# Altium schematic sheet 1_ABSTM32_Power.SchDoc
size A4; SheetNumber: 2; SheetTotal: 4
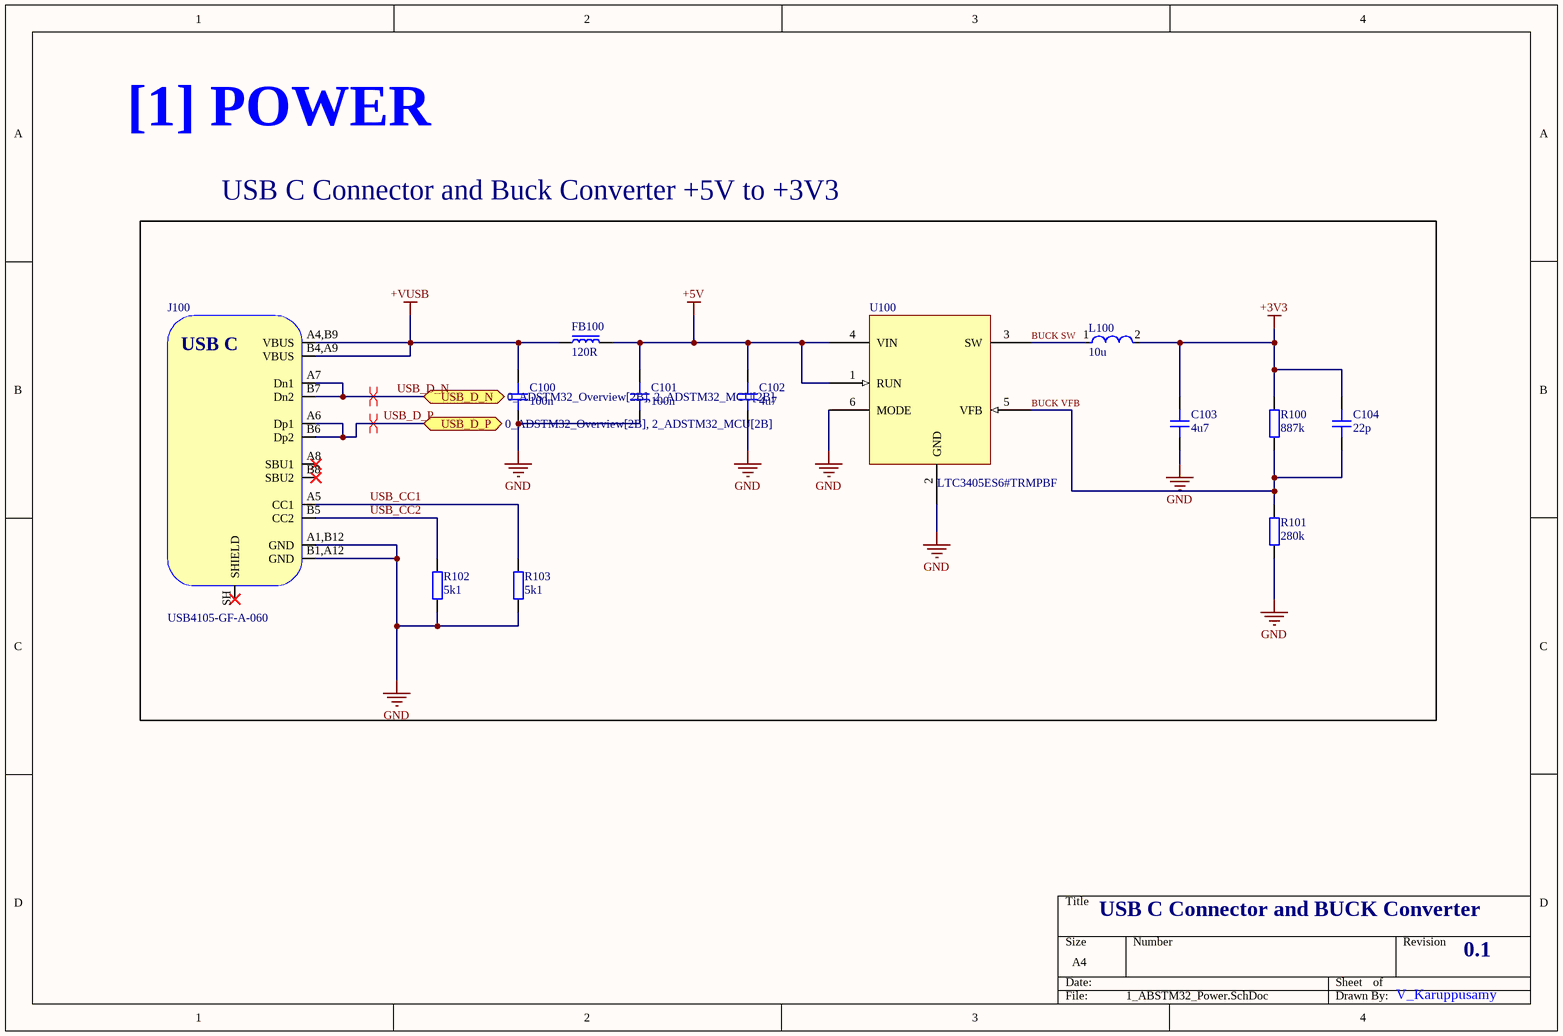
[diagram p0: 1_ABSTM32_Power.SchDoc]

## Parts
C100  100n  [CAP_0805]
C101  100n  [CAP_0805]
C102  4u7  [CAP_0805]
C103  4u7  [CAP_0805]
C104  22p  [CAP_0201]
FB100  120R  [FB_0402]
J100  USB4105-GF-A-060  [USB4105-GF-A-060]
L100  10u  [FP-NRH2412-MFG]
R100  887k  [RES_0603]
R101  280k  [RES_0603]
R102  5k1  [RES_0603]
R103  5k1  [RES_0603]
U100  LTC3405ES6#TRMPBF  [SOT-23-6]

## Blocks framed on the sheet
USB C Connector and Buck Converter +5V to +3V3: C100-C104 FB100 J100 L100 R100-R103 U100

## Ports
USB_D_N (bidir, see 0_ADSTM32_Overview[2B], 2_ADSTM32_MCU[2B]), USB_D_P (bidir, see 0_ADSTM32_Overview[2B], 2_ADSTM32_MCU[2B])

## Nets
+3V3: C103.2 C104.2 L100.2 R100.2
+5V: C101.2 C102.2 FB100.2 U100.1(RUN) U100.4(VIN)
+VUSB: C100.2 FB100.1 J100.A4,B9(VBUS) J100.B4,A9(VBUS)
GND: C100.1 C101.1 C102.1 C103.1 J100.A1,B12(GND) J100.B1,A12(GND) R101.1 R102.1 R103.1 U100.2(GND) U100.6(MODE)
BUCK SW: L100.1 U100.3(SW)
BUCK VFB: C104.1 R100.1 R101.2 U100.5(VFB)
USB_CC1: J100.A5(CC1) R103.2
USB_CC2: J100.B5(CC2) R102.2
USB_D_N: J100.A7(Dn1) J100.B7(Dn2) ; port USB_D_N
USB_D_P: J100.A6(Dp1) J100.B6(Dp2) ; port USB_D_P

Not connected (* = marked no-connect by the designer): J100 A8(SBU1)* B8(SBU2)* SH(SHIELD)*

## Layout directives
differential pair; differential pair class *: USB_D_N, USB_D_P

## Notes on the sheet
- [1] POWER
- USB C Connector and BUCK Converter
- 0.1
- V_Karuppusamy
- (in symbol USB4105-GF-A-060) USB C

## Library data of the parts
C100-C104 = CAP_0805_16V: Capacitor SMD 0805 16V
FB100 = FB_0402: Ferrite Bead SMD 0402
J100 = USB4105-GF-A-060: USB Connector Type C SMT 12 Pin; Manufacturer: GCT; Manufacturer Part Number: USB4105-GF-A-060
L100 = CMP-14484-000582-1: Shielded Wirewound Inductor 10uH 20% 0.51A 0.72Ω SMD; DC Resistance (DCR): 600mR; Current Rating: 450mA; Saturation Current: 810mA; Core Material: Ferrite; Test Frequency: 100kHz; Self Resonant Frequency: 29MHz; Termination: SMD/SMT; Shielding: Shielded; Height - Seated (Max): 0.047inch; Case/Package: Nonstandard; Tolerance: 20%; Height: 1.2mm; Package Quantity: 2500; Mount: Surface Mount; Min Operating Temperature: -25°C; Inductance: 10uH; Width: 0.095inch; Length: 0.095inch; RoHS Compliant: Yes; Max DC Current: 810mA; Packaging: Tape and Reel; Max Operating Temperature: 120°C; Halogen Free: Halogen Free
R100-R103 = RES_0603: Resistor SMD 0603; Manufacturer: *; Manufacturer Part Number: *; Distributor Link: *
U100 = LTC3405ES6#TRMPBF: 1.5MHz, 300mA / Synchronous Step-Down / Regulator in ThinSOT; Manufacture: Analogdevices; Manufacture Part Number: LTC3405ES6#TRMPBF